# EasyEDA Pro project TC358870 HDMI2MIPI.epro, board driver
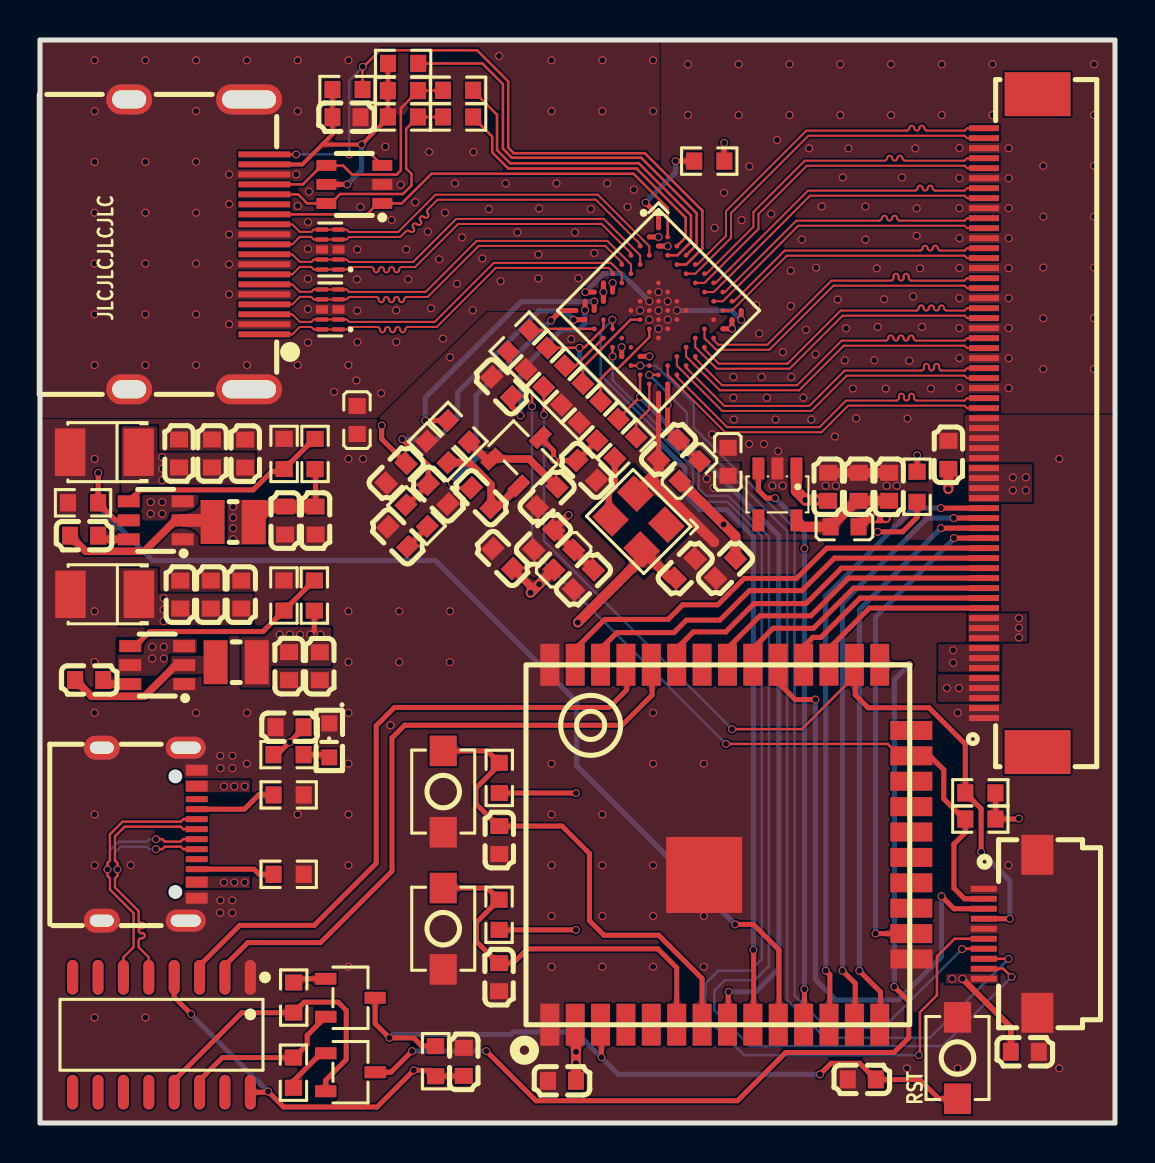
[diagram p8: board, top side]
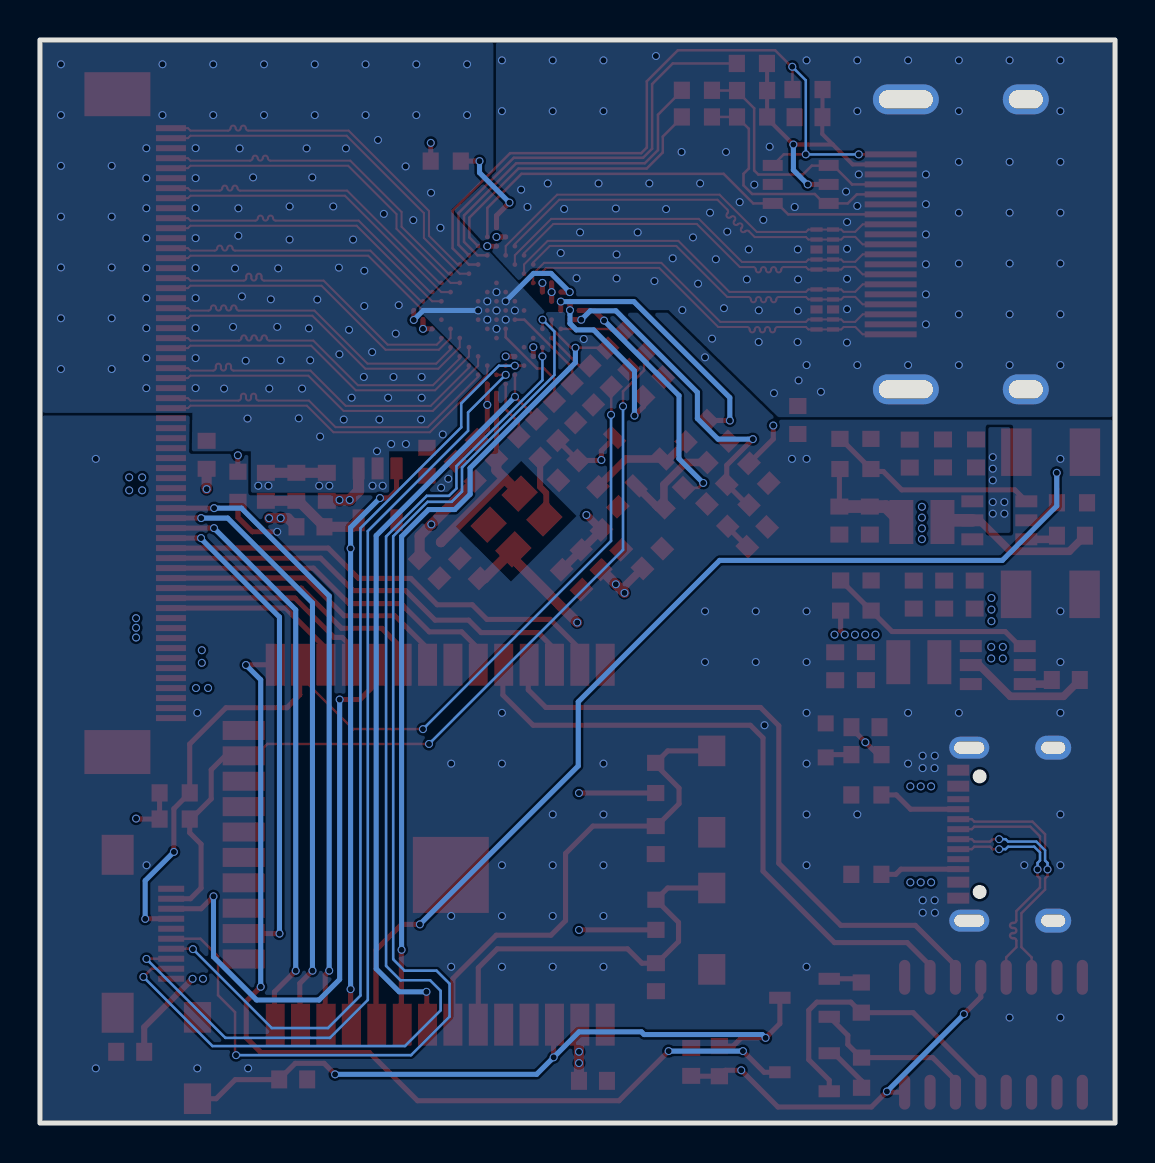
[diagram p9: board, bottom side, seen from below]

Outline 53.79 x 54.16 mm; copper layers: Top Layer, Inner1, Inner2, Bottom Layer. Coordinates in mm from the lower left corner of the outline.
Outline path: rectangle 0,54.16 53.79,0
Stack: Top Layer 0.035mm 外层铜厚1oz / Dielectric1 0.2104mm 7628 RC49% 8.6mil / Inner1 0.0152mm 内层铜厚 / Dielectric2 1.065mm 1.1mm H/HOZ Copper / Inner2 0.0152mm 内层铜厚 / Dielectric3 0.2104mm 7628 RC49% 8.6mil / Bottom Layer 0.035mm 外层铜厚1oz

## Design rules (mm)
net HDMI_CP: HDMI_C
net HDMI_D0P: HDMI_D0
net HDMI_D1P: HDMI_D1
net HDMI_D2P: HDMI_D2
net HDMI_CN: HDMI_C
net HDMI_D0N: HDMI_D0
net HDMI_D1N: HDMI_D1
net HDMI_D2N: HDMI_D2
net MIPI1_D3P: MIPI1_D3
net MIPI1_D3N: MIPI1_D3
net MIPI1_D2P: MIPI1_D2
net MIPI1_D2N: MIPI1_D2
net MIPI1_CP: MIPI1_C
net MIPI1_CN: MIPI1_C
net MIPI1_D1P: MIPI1_D1
net MIPI1_D1N: MIPI1_D1
net MIPI1_D0P: MIPI1_D0
net MIPI1_D0N: MIPI1_D0
net MIPI0_D3N: MIPI0_D3
net MIPI0_D2N: MIPI0_D2
net MIPI0_CN: MIPI0_C
net MIPI0_D1N: MIPI0_D1
net MIPI0_D0N: MIPI0_D0
net MIPI0_D3P: MIPI0_D3
net MIPI0_D2P: MIPI0_D2
net MIPI0_CP: MIPI0_C
net MIPI0_D1P: MIPI0_D1
net MIPI0_D0P: MIPI0_D0
net USB_N: USB
net USB_P: USB
template: 用户自定义配置
spacing copperThickness1oz (default): track to track 0.102, other pairs 0.102 to 0.3
spacing copperThickness2oz: track to track 0.203, other pairs 0.152 to 0.3
spacing copperThicknessInner0.5oz: track to track 0.089, other pairs 0.152 to 0.3
track width copperThickness1oz (default): min 0.102, default 0.254, max 2.54
track width copperThickness0.5oz: min 0.089, default 0.254, max 2.54
track width copperThickness2oz: min 0.203, default 0.254, max 2.54
differential pair differentialPair (default): width min 0.127, default 0.127, max 2.54; gap min 0.127, default 0.127
differential pair 5mil: width min 0.102, default 0.102, max 2.54; gap min 0.152, default 0.152
differential pair usb: width min 0.122, default 0.122, max 0.122; gap min 0.127, default 0.127
via viaSize (default): diameter min 0.399, default 0.399, max 10; hole min 0.3, default 0.3, max 6.299
net HDMI_CP uses 5mil
net HDMI_D0P uses 5mil
net HDMI_D1P uses 5mil
net HDMI_D2P uses 5mil
net HDMI_CN uses 5mil
net HDMI_D0N uses 5mil
net HDMI_D1N uses 5mil
net HDMI_D2N uses 5mil
net MIPI1_D3P uses 5mil
net MIPI1_D3N uses 5mil
net MIPI1_D2P uses 5mil
net MIPI1_D2N uses 5mil
net MIPI1_CP uses 5mil
net MIPI1_CN uses 5mil
net MIPI1_D1P uses 5mil
net MIPI1_D1N uses 5mil
net MIPI1_D0P uses 5mil
net MIPI1_D0N uses 5mil
net MIPI0_D3N uses 5mil
net MIPI0_D2N uses 5mil
net MIPI0_CN uses 5mil
net MIPI0_D1N uses 5mil
net MIPI0_D0N uses 5mil
net MIPI0_D3P uses 5mil
net MIPI0_D2P uses 5mil
net MIPI0_CP uses 5mil
net MIPI0_D1P uses 5mil
net MIPI0_D0P uses 5mil
net USB_N uses usb
net USB_P uses usb
diff pair HDMI_C uses 5mil
diff pair HDMI_D0 uses 5mil
diff pair HDMI_D1 uses 5mil
diff pair HDMI_D2 uses 5mil
diff pair MIPI1_D3 uses 5mil
diff pair MIPI1_D2 uses 5mil
diff pair MIPI1_C uses 5mil
diff pair MIPI1_D1 uses 5mil
diff pair MIPI1_D0 uses 5mil
diff pair MIPI0_D3 uses 5mil
diff pair MIPI0_D2 uses 5mil
diff pair MIPI0_C uses 5mil
diff pair MIPI0_D1 uses 5mil
diff pair MIPI0_D0 uses 5mil
diff pair USB uses usb

## Placement (name value [footprint] x y rotation side)
C1  10uF  [C0603]  15.34 50.3 180 top
C2  10uF  [C0603]  23.15 28.23 315 top
C3  10uF  [C0603]  34.3 27.74 45 top
C4  100nF  [C0603]  25.2 29.17 45 top
C5  100nF  [C0603]  27.35 32.64 135 top
C6  100nF  [C0603]  27.19 27.17 45 top
C7  100nF  [C0603]  31.45 33.68 45 top
C8  1nF  [C0603]  19.92 31.45 135 top
C9  1nF  [C0603]  22.07 31.27 315 top
C10  100nF  [C0603]  23.09 36.82 315 top
C11  100nF  [C0603]  17.9 29.31 315 top
C12  5pF  [C0603]  25.37 31.31 45 top
C15  10uF  [C0603]  17.82 32.49 45 top
C16  10uF  [C0603]  26.12 2.11 0 top
C17  10uF  [C0603]  12.49 19.79 0 top
C18  10uF  [C0603]  49.27 3.56 180 top
C41  100nF  [C0603]  32.28 27.73 225 top
C54  1uF  [C0603]  39.44 31.82 270 top
C55  1uF  [C0603]  40.96 31.82 270 top
C60  10uF  [C0603]  42.48 31.82 270 top
C61  100nF  [C0603]  45.45 33.42 270 top
C71  100nF  [C0603]  2.46 22.16 180 top
C72  10uF  [C0603]  7.02 26.43 270 top
C73  10uF  [C0603]  10.07 26.43 270 top
C74  100nF  [C0603]  8.55 26.43 270 top
C75  22uF  [C0603]  14 22.84 90 top
C76  22uF  [C0603]  12.46 22.85 90 top
C77  100nF  [C0603]  2.21 29.37 180 top
C78  10uF  [C0603]  6.96 33.48 270 top
C79  10uF  [C0603]  10.27 33.48 270 top
C80  100nF  [C0603]  8.61 33.48 270 top
C81  22uF  [C0603]  12.27 30.13 90 top
C82  22uF  [C0603]  13.79 30.13 90 top
C84  100uF  [CAP-SMD_L3.5-W2.8-R-RD]  3.22 33.55 0 top
C86  100uF  [CAP-SMD_L3.5-W2.8-R-RD]  3.24 26.44 0 top
C87  1uF  [C0603]  41.12 2.18 180 top
C88  100nF  [C0603]  21.2 3.06 270 top
C89  100nF  [C0603]  22.97 7.29 90 top
C90  100nF  [C0603]  22.98 14.15 270 top
ESD1  ESD7004MUTAG  [UDFN-10_L2.5-W1.0-P0.50-BL]  14.52 40.69 90 top
ESD2  ESD7004MUTAG  [UDFN-10_L2.5-W1.0-P0.50-BL]  14.52 43.68 90 top
ESD3  NUP4114HMR6T1G  [SOT-23-6_L2.9-W1.6-P0.95-LS2.8-BR]  15.73 46.94 0 top
FB1  BLM18PG121SN1D  [L0603]  26.21 28.17 45 top
FB2  BLM18PG121SN1D  [L0603]  32.51 32.6 45 top
FB3  BLM18PG121SN1D  [L0603]  40.25 29.82 0 top
FB6  BLM18PG121SN1D  [L0603]  15.87 35.16 90 top
FB7  BLM18PG121SN1D  [L0603]  34.42 33.07 90 top
FPC1  AFC01-S60FCA-00  [FPC-SMD_AFC01-S60FCC-00]  48.57 35 90 top
FPC2  AFC01-S10FCA-00  [FPC-SMD_P0.5-10P_FGS-XJ-H2.0]  48.56 9.47 270 top
HDMI1  HDMI 19PIN 043  [HDMI-SMD_HDMI-19PIN-043]  7.84 43.94 270 top
L6  2.2uH  [IND-SMD_L2.5-W2.0]  9.82 23.04 0 top
L7  2.2uH  [IND-SMD_L2.5-W2.0]  9.66 30.06 180 top
LED2  -  [LED0603-R-RD_WHITE]  14.48 19.13 270 top
Q1  S8050  [SOT-23-3_L2.9-W1.6-P1.90-LS2.8-BR]  24.16 33.41 225 top
Q2  S8050  [SOT-23-3_L2.9-W1.6-P1.90-LS2.8-BR]  15.53 2.54 180 top
Q3  S8050  [SOT-23-3_L2.9-W1.6-P1.90-LS2.8-BR]  15.53 6.26 180 top
R3  47kΩ  [R0603]  18.16 50.31 180 top
R4  47kΩ  [R0603]  18.16 51.63 180 top
R5  1kΩ  [R0603]  18.17 52.99 0 top
R6  2.2kΩ  [R0603]  15.39 51.68 0 top
R7  33Ω  [R0603]  20.92 50.31 0 top
R8  33Ω  [R0603]  20.92 51.65 0 top
R9  10kΩ  [R0603]  28.41 34.67 225 top
R10  2kΩ  [R0603]  33.48 48.11 0 top
R11  47kΩ  [R0603]  24.85 38.22 225 top
R12  10kΩ  [R0603]  27.52 35.56 225 top
R13  10kΩ  [R0603]  26.63 36.44 225 top
R14  33Ω  [R0603]  29.29 33.78 225 top
R15  33Ω  [R0603]  25.74 37.33 225 top
R16  33Ω  [R0603]  23.96 39.11 225 top
R17  1.5kΩ  [R0603]  20.93 34.6 315 top
R18  1kΩ  [R0603]  18.84 30.38 135 top
R19  1kΩ  [R0603]  19.88 33.56 315 top
R24  10kΩ  [R0603]  19.79 3.09 270 top
R29  10kΩ  [R0603]  47.05 16.51 0 top
R30  10kΩ  [R0603]  47.05 15.2 0 top
R32  100kΩ  [R0603]  2.15 31.02 180 top
R33  100kΩ  [R0603]  43.88 31.82 270 top
R34  1kΩ  [R0603]  12.43 18.42 0 top
R63  10kΩ  [R0603]  12.2 26.38 270 top
R64  33.2kΩ  [R0603]  13.73 26.38 270 top
R65  10kΩ  [R0603]  12.21 33.46 270 top
R67  4.32kΩ  [R0603]  13.76 33.46 270 top
R74  5.1kΩ  [R0603]  12.44 12.44 180 top
R75  5.1kΩ  [R0603]  12.44 16.41 180 top
R76  10kΩ  [R0603]  12.68 2.52 270 top
R77  10kΩ  [R0603]  12.69 6.27 90 top
R78  10kΩ  [R0603]  22.98 17.26 270 top
R79  10kΩ  [R0603]  22.97 10.41 270 top
SW4  -  [SW-SMD_L4.0-W2.9-LS5.0]  45.9 3.25 90 top
SW5  -  [SW-SMD_L4.0-W2.9-LS5.0]  20.17 9.72 270 top
SW6  -  [SW-SMD_L4.0-W2.9-LS5.0]  20.17 16.57 270 top
U1  TC358870XBG(NOK)  [P-VFBGA-80_L7.0-W7.0-R10-C10-P0.65-TL]  30.95 40.64 315 top
U12  LP5907MFX-1.8/NOPB  [SOT-23-5_L3.0-W1.7-P0.95-LS2.8-BR]  36.9 31.44 90 top
U15  TPS562208DDCR  [SOT-23-6_L2.9-W1.6-P0.95-LS2.8-BR#2]  5.87 22.9 0 top
U16  TPS562208DDCR  [SOT-23-6_L2.9-W1.6-P0.95-LS2.8-BR#2]  5.79 30.14 0 top
U18  ESP32-WROOM-32U-N4  [WIFIM-SMD_38P-L19.2-W18.0-P1.27]  34.55 13.92 180 top
U19  CH340C  [SOP-16_L10.0-W3.9-P1.27-LS6.0-BL]  6.08 4.41 180 top
USB1  TYPE-C 16PIN 2MD(073)  [USB-C-SMD_TYPE-C-6PIN-2MD-073]  5.47 14.45 270 top
X1  48MHz  [OSC-SMD_4P-L3.2-W2.5-BL]  29.94 30.08 135 top

## Footprints (pads in the part's own frame, mm; a bottom-side part is the same pattern mirrored in y, then rotated)
C0603
  rect 0.8x0.9 smd: 1(-0.7,0) 2(0.7,0)
CAP-SMD_L3.5-W2.8-R-RD
  rect 1.524x2.376 smd: 1(1.714,0) 2(-1.714,0)
FPC-SMD_AFC01-S60FCC-00
  rect 0.3x1.5 smd: 1(-14.75,1.34) 2(-14.251,1.34) 3(-13.751,1.34) 4(-13.25,1.34) 5(-12.75,1.34) 6(-12.249,1.34) 7(-11.749,1.34) 8(-11.25,1.34) 9(-10.751,1.34) 10(-10.251,1.34) 11(-9.75,1.34) 12(-9.249,1.34) 13(-8.749,1.34) 14(-8.25,1.34) 15(-7.75,1.34) 16(-7.25,1.34) 17(-6.75,1.34) 18(-6.25,1.34) 19(-5.75,1.34) 20(-5.249,1.34) 21(-4.749,1.34) 22(-4.251,1.34) 23(-3.751,1.34) 24(-3.25,1.34) 25(-2.75,1.34) 26(-2.249,1.34) 27(-1.749,1.34) 28(-1.25,1.34) 29(-0.751,1.34) 30(-0.251,1.34) 31(0.25,1.34) 32(0.75,1.34) 33(1.25,1.337) 34(1.751,1.337) 35(2.252,1.337) 36(2.749,1.34) 37(3.249,1.34) 38(3.75,1.34) 39(4.25,1.34) 40(4.751,1.34) 41(5.251,1.34) 42(5.749,1.34) 43(6.25,1.34) 44(6.75,1.34) 45(7.25,1.34) 46(7.75,1.34) 47(8.251,1.34) 48(8.75,1.34) 49(9.249,1.34) 50(9.749,1.34) 51(10.25,1.34) 52(10.751,1.34) 53(11.251,1.34) 54(11.751,1.34) 55(12.25,1.34) 56(12.749,1.34) 57(13.249,1.34) 58(13.75,1.34) 59(14.251,1.34) 60(14.751,1.34)
  rect 2.2x3.3 smd: 61(-16.45,-1.34) 62(16.45,-1.34)
FPC-SMD_P0.5-10P_FGS-XJ-H2.0
  rect 0.3x1.3 smd: 1(-2.25,-1.339) 2(-1.75,-1.339) 3(-1.25,-1.34) 4(-0.75,-1.339) 5(-0.25,-1.34) 6(0.25,-1.339) 7(0.75,-1.339) 8(1.25,-1.339) 9(1.75,-1.339) 10(2.25,-1.34)
  rect 2x1.6 smd: 11(3.95,1.34) 12(-3.95,1.34)
HDMI-SMD_HDMI-19PIN-043
  rect 0.3x2.6 smd: 1(4.5,3.38) 2(4,3.38) 3(3.5,3.38) 4(3,3.38) 5(2.5,3.38) 6(2,3.38) 7(1.5,3.38) 8(1,3.38) 9(0.5,3.38) 10(0,3.38) 11(-0.5,3.38) 12(-1,3.38) 13(-1.5,3.38) 14(-2,3.38) 15(-2.5,3.38) 16(-3,3.38) 17(-3.5,3.38) 18(-4,3.38) 19(-4.5,3.38)
  oval 1.5x3.3 hole 0.9x2.7: 20(-7.25,2.62) 20(7.25,2.62)
  oval 1.5x2.3 hole 0.9x1.7: 20(-7.25,-3.38) 20(7.25,-3.38)
IND-SMD_L2.5-W2.0
  rect 1.2x2.2 smd: 1(1.028,0) 2(-1.028,0)
L0603
  rect 0.8x0.864 smd: 1(-0.7,0) 2(0.7,0)
LED0603-R-RD_WHITE
  rect 0.8x0.8 smd: 1(0.851,0) 2(-0.851,0)
OSC-SMD_4P-L3.2-W2.5-BL
  rect 1.4x1.2 smd: 1(-1.1,-0.875) 2(1.1,-0.875) 3(1.1,0.875) 4(-1.1,0.875)
P-VFBGA-80_L7.0-W7.0-R10-C10-P0.65-TL
  round 0.24 smd: A1(-2.925,2.925) A2(-2.275,2.925) A3(-1.625,2.925) A4(-0.975,2.925) A5(-0.325,2.925) A6(0.325,2.925) A7(0.975,2.925) A8(1.625,2.925) A9(2.275,2.925) A10(2.925,2.925) B1(-2.925,2.275) B2(-2.275,2.275) B3(-1.625,2.275) B4(-0.975,2.275) B5(-0.325,2.275) B6(0.325,2.275) B7(0.975,2.275) B8(1.625,2.275) B9(2.275,2.275) B10(2.925,2.275) C1(-2.925,1.625) C2(-2.275,1.625) C9(2.275,1.625) C10(2.925,1.625) D1(-2.925,0.975) D2(-2.275,0.975) D4(-0.975,0.975) D5(-0.325,0.975) D6(0.325,0.975) D7(0.975,0.975) D9(2.275,0.975) D10(2.925,0.975) E1(-2.925,0.325) E2(-2.275,0.325) E4(-0.975,0.325) E5(-0.325,0.325) E6(0.325,0.325) E7(0.975,0.325) E9(2.275,0.325) E10(2.925,0.325) F1(-2.925,-0.325) F2(-2.275,-0.325) F4(-0.975,-0.325) F5(-0.325,-0.325) F6(0.325,-0.325) F7(0.975,-0.325) F9(2.275,-0.325) F10(2.925,-0.325) G1(-2.925,-0.975) G2(-2.275,-0.975) G4(-0.975,-0.975) G5(-0.325,-0.975) G6(0.325,-0.975) G7(0.975,-0.975) G9(2.275,-0.975) G10(2.925,-0.975) H1(-2.925,-1.625) H2(-2.275,-1.625) H9(2.275,-1.625) H10(2.925,-1.625) J1(-2.925,-2.275) J2(-2.275,-2.275) J3(-1.625,-2.275) J4(-0.975,-2.275) J5(-0.325,-2.275) J6(0.325,-2.275) J7(0.975,-2.275) J8(1.625,-2.275) J9(2.275,-2.275) J10(2.925,-2.275) K1(-2.925,-2.925) K2(-2.275,-2.925) K3(-1.625,-2.925) K4(-0.975,-2.925) K5(-0.325,-2.925) K6(0.325,-2.925) K7(0.975,-2.925) K8(1.625,-2.925) K9(2.275,-2.925) K10(2.925,-2.925)
R0603
  rect 0.806x0.864 smd: 1(-0.753,0) 2(0.753,0)
SOP-16_L10.0-W3.9-P1.27-LS6.0-BL
  oval 0.56x1.745 smd: 1(-4.445,-2.873) 2(-3.175,-2.873) 3(-1.905,-2.873) 4(-0.635,-2.873) 5(0.635,-2.873) 6(1.905,-2.873) 7(3.175,-2.873) 8(4.445,-2.873) 9(4.445,2.873) 10(3.175,2.873) 11(1.905,2.873) 12(0.635,2.873) 13(-0.635,2.873) 14(-1.905,2.873) 15(-3.175,2.873) 16(-4.445,2.873)
SOT-23-3_L2.9-W1.6-P1.90-LS2.8-BR
  rect 1.07x0.6 smd: 1(1.235,-0.95) 2(1.235,0.95) 3(-1.235,0)
SOT-23-5_L3.0-W1.7-P0.95-LS2.8-BR
  rect 1.1x0.6 smd: 1(1.3,-0.95) 2(1.3,0) 3(1.3,0.95) 4(-1.3,0.95) 5(-1.3,-0.95)
SOT-23-6_L2.9-W1.6-P0.95-LS2.8-BR
  rect 1x0.55 smd: 1(1.4,-0.95) 2(1.4,0) 3(1.4,0.95) 4(-1.4,0.95) 5(-1.4,0) 6(-1.4,-0.95)
SOT-23-6_L2.9-W1.6-P0.95-LS2.8-BR#2
  rect 1.1x0.6 smd: 1(1.35,-0.95) 2(1.35,0) 3(1.35,0.95) 4(-1.35,0.95) 5(-1.35,0) 6(-1.35,-0.95)
SW-SMD_L4.0-W2.9-LS5.0
  rect 1.53x1.36 smd: 1(-2.035,0) 2(2.035,0)
UDFN-10_L2.5-W1.0-P0.50-BL
  rect 0.22x0.609 smd: 1(-1,-0.414) 2(-0.5,-0.414) 4(0.5,-0.414) 5(1,-0.414) 6(1,0.414) 7(0.5,0.414) 9(-0.5,0.414) 10(-1,0.414)
  rect 0.41x0.609 smd: 3(0,-0.414) 8(0,0.414)
USB-C-SMD_TYPE-C-6PIN-2MD-073
  rect 0.55x1.1 smd: 1(-3.2,2.375) 2(-2.4,2.375) 11(2.4,2.375) 12(3.2,2.375)
  rect 0.3x1.1 smd: 3(-1.75,2.375) 4(-1.25,2.375) 5(-0.75,2.375) 6(-0.25,2.375) 7(0.25,2.375) 8(0.75,2.375) 9(1.25,2.375) 10(1.75,2.375)
  oval 1.1x2 hole 0.6x1.5: 13(-4.325,1.825) 14(4.325,1.825)
  oval 1.2x1.8 hole 0.6x1.2: 13(-4.325,-2.375) 14(4.325,-2.375)
WIFIM-SMD_38P-L19.2-W18.0-P1.27
  rect 0.95x2.1 smd: 1(9.045,9) 2(7.775,9) 3(6.505,9) 4(5.235,9) 5(3.965,9) 6(2.695,9) 7(1.425,9) 8(0.155,9) 9(-1.115,9) 10(-2.385,9) 11(-3.655,9) 12(-4.925,9) 13(-6.195,9) 14(-7.465,9) 25(-7.465,-9) 26(-6.195,-9) 27(-4.925,-9) 28(-3.655,-9) 29(-2.385,-9) 30(-1.115,-9) 31(0.155,-9) 32(1.425,-9) 33(2.695,-9) 34(3.965,-9) 35(5.235,-9) 36(6.505,-9) 37(7.775,-9) 38(9.045,-9)
  rect 2.1x0.95 smd: 15(-9.045,5.715) 16(-9.045,4.445) 17(-9.045,3.175) 18(-9.045,1.905) 19(-9.045,0.635) 20(-9.045,-0.635) 21(-9.045,-1.905) 22(-9.045,-3.175) 23(-9.045,-4.445) 24(-9.045,-5.715)
  rect 3.8x3.8 smd: 39(1.321,1.51)

## Nets
As in the schematic, except:
V3.3: C2.2 C15.2 C16.2 C17.2 C18.2 C41.2 C54.2 C75.2 C76.2 C88.2 FB1.1 FPC1.9 FPC1.10 FPC1.11 FPC2.10 L6.1 R24.2 R29.2 R30.2 R34.1 R64.2 R78.2 R79.2 U12.1 U18.2 U19.4 U19.16 X1.4
LX_3.3: C71.2 L6.2 U15.2

Pads without a net: FPC1 61 62; HDMI1 14; U1 J5 J6 J8; U12 4; U18 4 5 17 18 19 20 21 22 24 32; U19 7 8 9 10 11 12 15; USB1 3 9; X1 1

## Via types
v1: diameter 0.399, hole 0.299, Top Layer to Bottom Layer, 330 vias
v2: diameter 0.4, hole 0.3, Top Layer to Bottom Layer, 72 vias

## Routing (per net, layer and track width the routed paths; a pad name or vN(x,y) marks a point on that pad's centre or on a via; arc(x,y) is an arc through that point)
GND: length 21.6
  Top Layer w0.254: v1(35.08,40.16) 35.08,40.16 U1.A10 ; v1(41.92,29.57) 43.16,29.57 43.88,30.29 R33.2 ; U1.K10 30.95,34.04 30.95,34.04 C7.1 ; U1.H1 v2(27.28,41.55)
  Top Layer w0.508: C7.1 30.95,32.64 30.54,32.23 ; 30.54,32.23 29.78,31.48 ; 30.54,32.23 33.72,29.05 33.72,29.05
  Bottom Layer w0.254: v1(35.08,40.16) 34.61,40.64 v2(31.87,40.64) ; v2(27.28,41.55) 28.22,42.49 29.09,42.49 30.48,41.09
  vias: v1(2.73,33.21) v1(2.73,25.59) v1(2.73,23.05) v1(2.73,20.51) v1(2.73,15.43) v1(2.73,12.89) v1(2.73,5.27) v1(4.54,12.9) v1(5.27,5.27) v1(7.81,20.51) v1(10.35,20.51) v1(10.35,17.97) v1(12.89,15.43) v1(15.43,33.21) v1(15.43,25.59) v1(15.43,23.05) v1(15.43,20.51) v1(15.43,17.97) v1(15.43,15.43) v1(15.43,12.89) v1(15.43,7.81) v1(16.16,33.21) v1(17.54,19.89) v1(17.97,25.59) v1(17.97,23.05) v1(20.51,38.29) v1(20.51,25.59) v1(20.51,23.05) v1(25.59,17.97) v1(25.59,15.43) v1(25.59,12.89) v1(25.59,10.35) v1(25.59,7.81) v1(28.13,15.43) v1(28.13,12.89) v1(28.13,10.35) v1(28.13,7.81) v1(30.67,20.51) v1(30.67,17.97) v1(30.67,12.89) v1(30.67,10.35) v1(30.67,7.81) v1(33.21,17.97) v1(33.21,10.35) v1(33.21,7.81) v1(33.36,32.22) v1(33.72,31.77) v1(43.37,2.73) v1(45.91,20.51) v1(45.91,2.73) v1(48.45,12.89) v1(50.99,33.21) v1(50.99,2.73) v2(9.02,18.37) v2(9.03,17.75) v2(9.02,11.14) v2(9.01,10.52) v2(9.63,18.37) v2(9.63,17.75) v2(9.62,11.14) v2(9.62,10.52) v2(26.58,39.21) v2(30.03,40.64) v2(30.49,41.09) v2(30.49,40.18) v2(30.95,41.55) v2(30.94,40.64) v2(30.94,39.72) v2(31.41,41.09) v2(31.41,40.18)
GND_P: length 3
  Top Layer w0.508: C54.1 C55.1 C60.1
  vias: v1(32.42,52.95) v1(32.42,50.41) v1(33.63,34.44) v1(33.75,44.77) v1(34.22,46.52) v1(34.69,37.31) v1(34.69,36.27) v1(34.72,35.18) v1(34.96,52.95) v1(34.96,50.41) v1(35.11,45.15) v1(35.49,47.84) v1(35.48,33.96) v1(35.84,40.9) v1(35.99,39.48) v1(36.1,37.31) v1(36.22,33.96) v1(36.37,36.27) v1(36.58,45.47) v1(36.8,35.18) v1(36.88,49.16) v1(36.93,33.6) v1(37.17,38.55) v1(37.5,52.95) v1(37.5,50.41) v1(37.56,42.62) v1(37.56,40.86) v1(37.58,37.31) v1(38.12,44.18) v1(38.2,36.27) v1(38.32,39.67) v1(38.48,48.74) v1(38.59,35.18) v1(38.81,38.45) v1(38.83,42.78) v1(39.11,45.84) v1(39.77,34.33) v1(39.91,41.18) v1(40.04,52.95) v1(40.04,50.41) v1(40.16,47.29) v1(40.27,38.14) v1(40.33,39.74) v1(40.45,48.74) v1(40.67,36.73) v1(40.84,35.24) v1(41.29,45.84) v1(41.3,44.18) v1(41.74,38.14) v1(41.87,42.74) v1(41.91,39.81) v1(42.23,41.19) v1(42.31,36.73) v1(42.58,52.95) v1(42.58,50.41) v1(43.12,47.29) v1(43.4,35.23) v1(43.49,38.12) v1(43.68,41.34) v1(43.8,48.74) v1(43.86,45.74) v1(43.86,44.37) v1(44.03,42.74) v1(44.13,39.81) v1(44.57,36.73) v1(45.12,52.95) v1(45.12,50.41) v1(46,48.75) v1(46,47.25) v1(46,45.75) v1(46,44.25) v1(46,42.75) v1(46,41.25) v1(46,39.75) v1(46,38.25) v1(46,36.75) v1(47.66,52.95) v1(47.66,50.41) v1(48.46,48.75) v1(48.46,47.25) v1(48.46,45.75) v1(48.46,44.25) v1(48.46,42.75) v1(48.46,41.25) v1(48.46,39.75) v1(48.46,38.25) v1(48.47,36.75) v1(50.2,47.87) v1(50.2,45.33) v1(50.2,42.79) v1(50.2,40.25) v1(50.2,37.71) v1(52.74,52.95) v1(52.74,50.41) v1(52.74,47.87) v1(52.74,45.33) v1(52.74,42.79) v1(52.74,40.25) v1(52.74,37.71) v2(36.64,31.87) v2(37.15,31.87) v2(39.31,31.87) v2(39.82,31.87) v2(42.36,31.87) v2(42.86,31.87)
GND_TMDS:
  vias: v1(2.73,53.14) v1(2.73,50.6) v1(2.73,48.06) v1(2.73,45.52) v1(2.73,42.98) v1(2.73,40.44) v1(2.73,37.9) v1(5.27,53.14) v1(5.27,48.06) v1(5.27,45.52) v1(5.27,42.98) v1(5.27,40.44) v1(5.27,37.9) v1(7.81,53.14) v1(7.81,50.6) v1(7.81,48.06) v1(7.81,45.52) v1(7.81,42.98) v1(7.81,40.44) v1(7.81,37.9) v1(10.35,53.14) v1(10.35,37.9) v1(12.89,53.14) v1(12.89,50.6) v1(12.9,45.86) v1(12.89,37.9) v1(13.46,46.58) v1(14.71,36.57) v1(15.43,53.14) v1(15.43,37.9) v1(15.87,43.69) v1(15.86,42.19) v1(15.87,40.62) v1(15.88,39.06) v1(15.83,37.14) v1(17.06,36.5) v1(17.28,48.83) v1(17.6,45.17) v1(17.82,40.64) v1(17.83,39.06) v1(18.32,43.69) v1(18.42,42.19) v1(18.78,46.05) v1(19.4,44.58) v1(19.46,48.56) v1(19.56,40.75) v1(19.97,43.2) v1(20.16,39.23) v1(20.26,45.53) v1(20.76,46.99) v1(20.86,41.97) v1(21.11,44.29) v1(21.69,48.56) v1(21.65,40.65) v1(22.13,43.25) v1(22.46,45.7) v1(22.97,53.36) v1(23.04,42.11) v1(23.3,46.99) v1(23.88,44.54) v1(24.97,45.73) v1(24.94,43.44) v1(24.94,42.24) v1(25.59,53.14) v1(25.59,50.6) v1(25.84,46.99) v1(26.77,44.54) v1(26.94,42.25) v1(27.56,45.71) v1(27.73,43.51) v1(28.13,53.14) v1(28.13,50.6) v1(28.38,46.99) v1(29.39,45.81) v1(29.71,46.68) v1(30.67,53.14) v1(30.67,50.6) v2(9.46,47.44) v2(9.46,45.95) v2(9.46,44.44) v2(9.46,42.95) v2(9.46,41.44) v2(9.46,39.94) v2(12.82,47.44) v2(13.41,45.06) v2(13.41,43.72) v2(13.41,42.22) v2(13.41,40.7) v2(13.41,39.03) v2(16.03,45.81) v2(18.05,46.93)
V1.1: length 55
  Top Layer w0.254: R67.2 13.79,32.68 C82.2
  Top Layer w0.508: FB2.1 33.07,31.05 33.09,31.05 v2(34.21,29.94) 34.79,29.35 C3.2
  Top Layer w0.635: C82.2 C81.2 11.46,30.83 L7.2
  Inner2 w0.762: v1(9.66,29.2) v1(9.66,29.74) v1(9.66,30.28) v1(9.66,30.82) 9.67,30.83 19.75,30.83 22.03,28.55 26.18,28.55 28.4,26.33 30.6,26.33 v2(34.21,29.94) 42.39,21.75 v1(45.38,21.75) v1(45.98,21.75)
V1.1_TC: length 24.3
  Top Layer w0.254: U1.K6 29.1,38.34 v2(29.1,38.8) ; 28.65,41.56 v2(28.65,42.01) ; 34.16,39.72 v2(34.62,39.72) U1.B10 ; v2(31.41,43.85) U1.B2 ; U1.J10 v2(31.41,35.91) 31.41,34.71 C7.2 31.94,34.16 FB2.2
  Inner2 w0.254: 29.32,39.02 29.32,41.34 v2(28.65,42.01) 29.57,42.01 30.17,42.61 ; 29.32,39.02 v2(29.1,38.8) ; 29.32,39.02 30.62,39.02 31.41,38.23 v2(31.41,35.91) ; v2(34.62,39.72) 31.72,42.61 30.17,42.61 ; 30.17,42.61 v2(31.41,43.85)
V1.8: length 5.3
  Top Layer w0.508: C55.2 40.98,31.1 ; C55.2 40.85,31.12 FB3.1 38.16,29.82 U12.5 ; C55.2 C60.2
V1.8_P: length 15.5
  Top Layer w0.508: FB3.2 41.38,30.25 v1(41.74,30.25) v1(42.32,30.25) ; v1(45.45,31.7) C61.2
  Inner2 w0.762: v1(45.45,31.7) 44.38,31.7 42.93,30.25 v1(42.32,30.25) ; v1(42.32,30.25) 45.69,26.88 v1(45.69,23.65) v1(45.69,23.01) ; v1(42.32,30.25) v1(41.74,30.25)
V3.3: length 196.4
  Top Layer w0.254: R79.2 26.81,9.66 v1(26.82,9.66) ; C17.2 13.19,19.74 11.86,18.42 R34.1 ; v1(26.82,16.5) 26.81,16.5 R78.2 ; R29.2 R30.2 48.95,15.2 v1(48.98,15.22) ; U19.4 6.71,6.29 v1(7.56,5.45) ; R64.2 13.73,24.63 v1(13.52,24.42) ; C15.2 17.1,34.21 v1(17.1,34.88) ; U19.16 11.38,1.54 v1(11.41,1.58) 12.19,0.8 16.87,0.8 v1(18.7,2.64) 19.5,2.64 R24.2 21.19,2.34 C88.2
  Top Layer w0.305: v1(46.15,7.21) 48.57,4.79 C18.2
  Top Layer w0.381: v1(24.54,26.51) 24.54,26.84 C2.2
  Top Layer w0.508: v1(26.91,25.03) 30.1,28.22 X1.4 31.55,27.24 C41.2 ; C16.2 v1(26.82,3) v1(26.82,3.56) 26.82,4.91 26.82,4.92 ; FB1.1 25.7,27.67 v1(24.97,26.94) v1(24.54,26.51)
  Top Layer w0.559: v2(38.8,31.16) v2(38.29,31.16) 37.84,31.6 U12.1 ; 39.39,31.16 38.8,31.16
  Inner2 w0.254: v1(11.99,24.42) 12.49,23.92 v1(12.49,19.04) ; v1(18.7,2.64) 19.06,3 v1(26.82,3)
  Inner2 w0.762: v1(48.98,15.22) v1(48.98,24.28) v1(48.98,24.77) v1(48.98,25.25) 48.98,29.47 47.17,31.27 47.17,32.48 45.41,34.25 42.13,34.25 41.29,33.41 39.31,33.41 38.29,32.38 v2(38.29,31.16) v2(38.8,31.16) ; v1(48.98,15.22) 49.94,14.26 49.94,6.91 49.03,6 47.37,6 v1(46.15,7.21) v1(45.63,7.21) ; v1(48.98,15.22) 31.81,15.22 26.82,20.21 ; 26.82,20.21 v1(26.82,16.5) v1(26.82,9.66) v1(26.82,3.56) v1(26.82,3) ; 26.82,20.21 26.82,25.12 ; v1(17.1,34.88) 16.29,34.08 10.65,34.08 8.22,31.65 8.22,28.19 v1(11.99,24.42) v1(12.5,24.42) v1(13.01,24.42) v1(13.52,24.42) v1(14.03,24.42) 22.45,24.42 v1(24.54,26.51) v1(24.97,26.94) 24.99,26.94 26.82,25.12 ; 26.82,25.12 v1(26.91,25.03)
  Bottom Layer w0.254: v1(7.56,5.45) 7.56,5.42 v1(11.41,1.58)
V3.3_TC: length 36.7
  Top Layer w0.254: v2(30.95,44.31) U1.B1 ; R10.2 34.23,48.11 v1(34.23,49.02) ; R9.2 26.87,33.13 25.72,33.13 v2(25.7,33.16) 25.7,33.62 25.03,34.28 ; U1.J7 v2(30.49,38.34) ; U1.H2 v2(28.19,41.55) U1.G1
  Top Layer w0.381: 27.68,27.67 26.71,28.65 FB1.2 26.69,28.66 C4.2 26.44,30.41 v1(26.45,30.41)
  Inner2 w0.254: v2(30.49,38.34) 29.45,38.34 28.94,37.83 28.31,37.83 27.79,37.31 27.79,40.13 28.19,40.53 v2(28.19,41.55) 28.19,42.3 30.2,44.31 v2(30.95,44.31) 34.23,47.6 v1(34.23,49.02)
  Inner2 w0.508: v1(26.45,30.41) 26.45,32.41 v2(25.7,33.16) 27.79,35.25 27.79,37.31
V5: length 104.9
  Inner2 w1.27: v1(6.12,33.3) v1(6.12,32.72) v1(6.12,32.14) v1(6.12,31.05) v1(5.54,30.47) 5.54,26.9 v1(6.18,26.26) 6.19,26.25 v1(6.19,23.81) v1(5.61,23.23) 5.01,22.63 5.01,16.44 6.96,14.49 11.54,14.49 16.39,9.64 16.39,2.93 18.12,1.2 46.7,1.2 51.72,6.22 51.72,30.93 50.67,31.98 48.88,31.98
  vias: v1(5.54,31.05) v1(5.61,23.81) v1(6.12,30.47) v1(6.18,25.68) v1(6.18,25.1) v1(6.19,23.23) v1(48.67,32.29) v1(48.67,31.64) v1(49.32,32.29) v1(49.32,31.64) v2(9.2,16.84) v2(9.2,12.04) v2(9.72,16.84) v2(9.72,12.04) v2(10.24,16.84) v2(10.24,12.04)
V5_HDMI: length 16.2
  Top Layer w0.203: R5.1 17.41,52.98 17.41,50.25 v1(16.09,48.93) 14.12,48.93 ; 11.23,47.94 13.13,47.94 14.12,48.93 ; 14.12,48.93 14.65,49.46 14.65,50.29 C1.2 14.64,51.68 R6.1
  Top Layer w0.254: ESD3.5 v1(15.37,46.94)
  Bottom Layer w0.254: v1(16.09,48.93) 16.09,47.66 v1(15.37,46.94)
BIASDA: length 8.7
  Top Layer w0.254: v1(24.04,35.38) 23.59,35.83 C10.2 ; U1.J1 v2(27.27,40.65)
  Bottom Layer w0.254: v2(27.27,40.65) 27.27,39.98 26.95,39.66 26.09,39.66 24.04,37.62 v1(24.04,35.38)
BS_1.1: length 1.6
  Top Layer w0.381: U16.6 3.09,29.19 C77.1
BS_3.3: length 1.4
  Top Layer w0.381: C71.1 3.37,21.95 U15.6
BTN1: length 19.6
  Top Layer w0.254: SW5.1 22.38,11.75 R79.1 21.84,10.04 21.84,9.07 22.92,7.99 C89.2 23.67,7.99 24.39,8.71 30.91,8.71 31.86,7.76 U18.6
BTN2: length 24.8
  Top Layer w0.254: SW6.1 22.38,18.61 R78.1 22.98,17.92 21.81,16.75 21.81,15.97 22.93,14.85 C90.1 26.12,14.85 27.49,13.48 27.49,10.12 28.22,9.39 30.96,9.39 33.13,7.22 U18.7
CEC: length 23.2
  Top Layer w0.127: U1.A2 31.41,45.76 29.7,47.47 19.58,47.47 18.1,45.99 ESD3.1 16.9,45.99 16.35,45.44 HDMI1.13
CLK_TC: length 2.9
  Top Layer w0.127: R14.1 29.83,35.03 30.49,35.69 U1.K9
DAOUT: length 13.2
  Top Layer w0.254: R17.1 19.28,35.14 v2(19.27,35.13) ; U1.J2 v2(27.73,41.08)
  Bottom Layer w0.254: v2(27.73,41.08) 24.07,41.08 19.27,36.28 v2(19.27,35.13)
DDC_SCL: length 13
  Top Layer w0.127: HDMI1.15 12.92,46.44 13.37,45.99 ESD3.6 14.55,45.99 15.02,46.46 18.16,46.46 18.59,46.89 18.59,47.47 18.32,47.74 18.32,49.72 R3.1 R7.1
DDC_SDA: length 13.1
  Top Layer w0.127: R8.1 20.15,51.63 R4.1 18.91,51.61 18.05,50.75 18.05,47.64 17.85,47.43 15.61,47.43 15.17,47.88 14.34,47.88 ESD3.4 14.1,47.89 13.16,46.95 13.16,46.94 HDMI1.16
DTR: length 15.5
  Top Layer w0.254: Q2.2 14.3,2.14 15.32,3.17 15.32,5.64 14.92,6.05 13.22,6.05 R77.1 10.1,5.52 6.71,2.13 U19.13
EN_V1.1: length 53.9
  Top Layer w0.254: 36.98,4.92 36.98,8.65 35.69,9.93 v1(34.78,9.93) ; v1(2.91,32.52) 2.91,31.71 2.91,31.7 R32.1 3.78,30.14 U16.5
  Bottom Layer w0.254: v1(34.78,9.93) 26.85,17.86 26.85,21.06 19.78,28.14 5.64,28.14 2.91,30.86 v1(2.91,32.52)
EN_V1.8: length 37.4
  Top Layer w0.254: v1(36.78,31.25) 36.33,31.25 35.94,31.64 U12.3 ; 38.25,4.92 v1(38.25,6.69) ; R33.1 43.88,32.58 v1(43.88,33.39)
  Inner2 w0.254: v1(43.88,33.39) 42.9,33.39 v1(38.25,28.74)
  Bottom Layer w0.254: v1(36.78,31.25) 38.25,29.78 v1(38.25,28.74) v1(38.25,6.69)
FB_1.1: length 10.6
  Top Layer w0.254: U16.4 5.01,31.66 10.67,31.66 11.59,32.58 12.12,32.58 12.21,32.67 R65.2 13.72,34.21 R67.1
FB_3.3: length 10.6
  Top Layer w0.254: U15.4 4.77,23.85 5.5,24.58 11.16,24.58 R63.2 13.71,27.13 R64.1
HDMI_CN: length 21.8
  Top Layer w0.102: HDMI1.12 12.62,44.94 13,44.57 13.58,44.57 13.7,44.68 ESD2.6 ESD2.5 15.34,44.68 15.46,44.56 17.92,44.56 19.79,46.43 27.91,46.43 30.49,43.85 U1.C2
HDMI_CP: length 21.8
  Top Layer w0.102: U1.C1 30.03,43.95 27.81,46.17 19.89,46.17 19.39,45.67 arc(19.36,45.59) 19.39,45.5 19.41,45.48 arc(19.41,45.3) 19.23,45.3 19.21,45.32 arc(19.03,45.32) 19.03,45.14 19.05,45.12 arc(19.05,44.94) 18.87,44.94 18.85,44.96 arc(18.68,44.96) 18.68,44.78 18.69,44.76 arc(18.69,44.58) 18.51,44.58 18.5,44.6 arc(18.41,44.63) 18.32,44.6 18.03,44.31 15.46,44.31 15.34,44.18 ESD2.4 ESD2.7 13.7,44.18 13.57,44.31 13,44.31 12.62,43.94 HDMI1.10
HDMI_D0N: length 21.2
  Top Layer w0.102: HDMI1.9 12.62,43.44 13,43.07 13.58,43.07 13.7,43.18 ESD2.9 ESD2.2 15.34,43.18 15.46,43.06 18.66,43.06 20.82,45.22 28.21,45.22 30.03,43.39 U1.D2
HDMI_D0P: length 21.2
  Top Layer w0.102: 29.57,43.39 29.57,43.5 28.1,44.96 20.92,44.96 18.77,42.81 18.1,42.81 arc(18.01,42.77) 17.97,42.68 17.97,42.66 arc(17.84,42.54) 17.72,42.66 17.72,42.68 arc(17.59,42.81) 17.46,42.68 17.46,42.66 arc(17.34,42.54) 17.21,42.66 17.21,42.68 arc(17.08,42.81) 16.95,42.68 16.95,42.66 arc(16.83,42.54) 16.7,42.66 16.7,42.68 arc(16.66,42.77) 16.57,42.81 15.46,42.81 15.34,42.68 ESD2.1 ESD2.10 13.7,42.68 13.57,42.81 13,42.81 12.62,42.44 HDMI1.7
HDMI_D1N: length 20.6
  Top Layer w0.102: 29.57,42.47 29.57,42.93 28.38,44.12 21.84,44.12 19.29,41.56 15.46,41.56 15.34,41.69 ESD1.5 ESD1.6 13.7,41.69 13.58,41.57 13,41.57 12.62,41.94 HDMI1.6
HDMI_D1P: length 20.6
  Top Layer w0.102: U1.E1 29.11,43.03 28.28,43.86 21.95,43.86 19.4,41.31 18.35,41.31 arc(18.26,41.27) 18.22,41.18 18.22,41.17 arc(18.09,41.04) 17.97,41.17 17.97,41.18 arc(17.84,41.31) 17.71,41.18 17.71,41.17 arc(17.58,41.04) 17.46,41.17 17.46,41.18 arc(17.33,41.31) 17.2,41.18 17.2,41.17 arc(17.08,41.04) 16.95,41.17 16.95,41.18 arc(16.91,41.27) 16.82,41.31 15.46,41.31 15.34,41.19 ESD1.4 ESD1.7 13.7,41.19 13.57,41.31 13,41.31 12.62,40.94 HDMI1.4
HDMI_D2N: length 20.1
  Top Layer w0.102: U1.F2 29.11,42.47 28.56,43.02 22.7,43.02 19.75,40.06 15.46,40.06 15.34,40.19 ESD1.2 ESD1.9 13.7,40.19 13.58,40.06 13,40.06 12.62,40.44 HDMI1.3
HDMI_D2P: length 20.1
  Top Layer w0.102: 28.65,42.47 28.65,42.58 28.46,42.76 22.8,42.76 19.85,39.81 18.4,39.81 arc(18.31,39.77) 18.28,39.68 18.28,39.66 arc(18.15,39.54) 18.02,39.66 18.02,39.68 arc(17.9,39.81) 17.77,39.68 17.77,39.66 arc(17.64,39.54) 17.52,39.66 17.52,39.68 arc(17.39,39.81) 17.26,39.68 17.26,39.66 arc(17.13,39.54) 17.01,39.66 17.01,39.68 arc(16.97,39.77) 16.88,39.81 15.46,39.81 15.34,39.69 ESD1.1 ESD1.10 13.7,39.69 13.58,39.81 12.99,39.81 12.62,39.44 HDMI1.1
HPDI: length 21.3
  Top Layer w0.127: R5.2 22.13,52.99 23.16,51.96 23.16,48.72 23.61,48.27 30.08,48.27 32.85,45.5 32.85,43.92 32.32,43.39
HPDO: length 38
  Top Layer w0.127: ESD3.3 16.57,48.44 v2(15.47,48.44) ; U1.B4 32.33,42.93 33.14,43.74 33.14,45.62 30.26,48.5 23.71,48.5 23.43,48.78 23.43,52.09 21.87,53.65 17.01,53.65 16.18,52.82 v1(16.15,52.82) 16.14,52.82 R6.2 ; HDMI1.19 v2(12.82,48.44)
  Bottom Layer w0.127: v2(12.82,48.44) v2(15.47,48.44) 15.47,52.15 v1(16.15,52.82)
I2S_OSCK: length 61.2
  Top Layer w0.127: FPC2.6 45.75,9.22 44.88,8.34 44.88,6.39 44.03,5.54 44.03,3.44 v1(43.97,3.39) ; v2(28.64,40.18) 28.64,39.72 28.65,39.72
  Bottom Layer w0.127: v2(28.64,40.18) 28.05,39.58 28.05,37.41 32.67,32.78 32.67,31.58 33.19,31.06 34.39,31.06 36.11,29.34 36.11,8.19 35.54,7.62 33.94,7.62 33.29,6.97 33.29,5.32 35.22,3.39 v1(43.97,3.39)
I2S_SCK: length 47.4
  Top Layer w0.127: v2(30.03,37.87) 30.02,37.88 29.57,37.88 ; FPC2.7 46.15,8.72 v1(46.13,8.7)
  Bottom Layer w0.127: v2(30.03,37.87) 30.82,37.87 32.71,35.99 32.71,34.79 37.75,29.75 37.75,6.37 39.38,4.75 42.19,4.75 v1(46.13,8.7)
I2S_SD0: length 49.3
  Top Layer w0.127: U1.J9 30.94,37.42 v2(30.49,37.42) ; v1(48.46,8.2) 48.45,8.22 FPC2.8
  Bottom Layer w0.127: v2(30.49,37.42) 32.37,35.53 32.37,34.62 37.38,29.6 37.38,6.15 39.28,4.26 44.51,4.26 v1(48.46,8.2)
I2S_WFS: length 57.7
  Top Layer w0.127: v1(48.61,7.31) 48.2,7.72 FPC2.9 ; U1.K5 28.65,38.34
  Bottom Layer w0.127: v1(48.61,7.31) 45.15,3.85 35.52,3.85 33.74,5.63 33.74,6.61 34.27,7.14 35.75,7.14 36.47,7.85 36.47,29.33 34.43,31.36 33.32,31.36 32.95,31.73 32.95,32.85 28.65,37.15 v2(28.65,38.34)
IIC_SCL: length 47.3
  Top Layer w0.127: v1(34.62,19.7) 38.12,19.7 40.79,22.37 ; R15.2 25.21,35.43 v2(25.22,35.42)
  Top Layer w0.254: v1(48.52,10.21) 48.51,10.22 FPC2.4 ; 40.79,22.92 40.79,21.41 41.43,20.77 44.48,20.77 46.29,18.95 R29.1 47.09,15.72 v1(47.09,13.56)
  Bottom Layer w0.127: v1(34.62,19.7) 25.22,29.11 v2(25.22,35.42)
  Bottom Layer w0.254: v1(47.09,13.56) 48.52,12.12 v1(48.52,10.21)
IIC_SDA: length 43.9
  Top Layer w0.127: v1(34.32,18.96) 42.41,18.96 43.01,18.36 43.56,18.36 ; v2(24.62,35.84) 24.62,36.59 23.56,37.64 23.56,38.45 R16.2
  Top Layer w0.254: FPC2.2 46.26,11.22 45.73,11.75 45.73,13.95 46.29,14.52 R30.1 46.23,15.2 45.22,16.21 45.22,17.66 44.52,18.36 43.56,18.36
  Bottom Layer w0.127: v1(34.32,18.96) 24.62,28.66 v2(24.62,35.84)
INT_TC: length 41.9
  Top Layer w0.127: U1.J3 28.19,39.74 27.22,38.77 v2(27,38.77) 25.4,38.77 R11.1
  Top Layer w0.254: 35.71,4.92 35.71,8.65 v1(35.69,8.66)
  Bottom Layer w0.254: v2(27,38.77) 27,38.03 32.26,32.76 32.26,31.44 33.03,30.68 34.34,30.68 35.69,29.33 v1(35.69,8.66)
IO0: length 50.1
  Top Layer w0.254: v1(43.48,22.91) 43.47,22.92 42.06,22.92 ; v1(22.33,3.6) 24.82,1.11 34.89,1.11 37.31,3.53 42.73,3.53 43.47,4.26 43.47,6.09 v1(42.74,6.81) ; v1(18.62,3.6) 17.56,2.54 Q2.3
  Bottom Layer w0.254: v1(42.74,6.81) 42.74,22.17 v1(43.48,22.91) ; v1(18.62,3.6) v1(22.33,3.6)
IO1: length 9.4
  Top Layer w0.254: 39.52,22.92 39.52,23.77 41.5,25.75 FPC1.12
IO2: length 11.5
  Top Layer w0.254: 38.21,23.47 38.25,22.92 ; 38.21,23.47 U18.28 ; 38.21,23.47 38.21,23.83 38.67,24.28 39.06,24.28 41.03,26.25 FPC1.13
IO3: length 13.6
  Top Layer w0.254: 35.71,22.92 35.71,23.77 36.68,24.74 38.7,24.74 40.71,26.75 FPC1.14
IO4: length 15.1
  Top Layer w0.254: FPC1.15 40.45,27.25 38.57,25.36 36.02,25.36 34.44,23.78 34.44,22.92
IO5: length 17.8
  Top Layer w0.254: 31.9,22.92 31.9,23.77 32.69,24.56 34.31,24.56 35.72,25.98 38.33,25.98 40.1,27.75 FPC1.16
IO6: length 21.8
  Top Layer w0.254: FPC1.17 39.75,28.25 38.12,26.62 35.49,26.62 34.02,25.15 32.34,25.15 31.72,24.53 28.86,24.53 28.09,23.75 28.09,22.92
IO7: length 23.3
  Top Layer w0.254: 26.82,22.92 26.82,23.74 28.26,25.19 31.42,25.19 32.16,25.92 33.91,25.92 35.23,27.24 37.85,27.24 39.36,28.75 FPC1.18
IO8: length 24.5
  Top Layer w0.254: 43.56,9.47 v1(41.8,9.47) ; FPC1.19 v1(45.73,29.25)
  Bottom Layer w0.254: v1(45.73,29.25) 45.73,29.23 41.8,25.3 41.8,9.6
IO9: length 29.1
  Top Layer w0.254: 47.23,29.75 v1(45.08,29.75) ; v1(40.99,7.62) 42.06,6.55 42.06,4.92
  Bottom Layer w0.254: v1(45.08,29.75) 40.99,25.66 v1(40.99,7.62)
IO10: length 30.2
  Top Layer w0.254: v1(40.15,7.62) 40.79,6.98 40.79,4.92 ; v1(45.72,30.25) 47.23,30.25
  Bottom Layer w0.254: v1(40.15,7.62) 40.15,26.01 44.39,30.25 v1(45.72,30.25)
IO11: length 31.3
  Top Layer w0.254: v1(45.07,30.75) FPC1.22 ; 39.52,4.92 39.52,7.42 v1(39.31,7.62)
  Bottom Layer w0.254: v1(39.31,7.62) 39.31,26.36 43.71,30.75 v1(45.07,30.75)
IR: length 4.8
  Top Layer w0.127: 28.05,36.09 28.05,37.22 28.56,37.73 28.93,37.73 30.49,39.29 30.49,39.72
LX_1.1: length 8.1
  Top Layer w0.381: U16.2 6.78,30.14 5.23,28.59 2.29,28.59 C77.2
  Top Layer w0.635: U16.2 8.55,30.14 L7.1
LX_3.3: length 6.4
  Top Layer w0.381: U15.2 6.8,22.9 5.24,21.34 2.58,21.34 C71.2
MIPI0_CN: length 17
  Top Layer w0.102: 32.32,38.8 32.32,38.34 34.02,36.64 37.98,36.64 40.22,38.87 46.26,38.87 46.38,38.75 FPC1.38
MIPI0_CP: length 17
  Top Layer w0.102: FPC1.39 46.38,39.25 46.26,39.13 43.84,39.13 arc(43.75,39.17) 43.71,39.25 43.71,39.27 arc(43.58,39.39) 43.46,39.27 43.46,39.25 arc(43.33,39.13) 43.2,39.25 43.2,39.27 arc(43.07,39.39) 42.95,39.27 42.95,39.25 arc(42.82,39.13) 42.69,39.25 42.69,39.27 arc(42.57,39.39) 42.44,39.27 42.44,39.25 arc(42.4,39.17) 42.31,39.13 40.11,39.13 37.88,36.9 34.12,36.9 32.78,38.24 U1.F10
MIPI0_D0N: length 18.1
  Top Layer w0.102: U1.H9 31.41,37.42 34.28,34.55 39.1,34.55 40.43,35.87 46.26,35.87 46.38,35.75 FPC1.32
MIPI0_D0P: length 18.1
  Top Layer w0.102: FPC1.33 46.38,36.25 46.26,36.13 43.86,36.13 arc(43.77,36.17) 43.73,36.26 43.73,36.35 arc(43.6,36.48) 43.48,36.35 43.48,36.26 arc(43.35,36.13) 43.22,36.26 43.22,36.35 arc(43.1,36.48) 42.97,36.35 42.97,36.26 arc(42.93,36.17) 42.84,36.13 40.33,36.13 39,34.8 34.38,34.8 31.86,37.32 U1.H10
MIPI0_D1N: length 17.5
  Top Layer w0.102: U1.G9 31.86,37.88 34.13,35.61 38.59,35.61 40.36,37.37 46.26,37.37 46.38,37.25 FPC1.35
MIPI0_D1P: length 17.5
  Top Layer w0.102: 32.32,37.88 32.32,37.78 34.24,35.86 38.49,35.86 40.25,37.63 44.1,37.63 arc(44.19,37.67) 44.23,37.75 44.23,37.85 arc(44.35,37.98) 44.48,37.85 44.48,37.75 arc(44.61,37.63) 44.73,37.75 44.73,37.85 arc(44.86,37.98) 44.99,37.85 44.99,37.75 arc(45.03,37.67) 45.12,37.63 46.26,37.63 46.38,37.75 FPC1.36
MIPI0_D2N: length 16.5
  Top Layer w0.102: 47.23,40.25 46.38,40.25 46.26,40.37 40.16,40.37 37.51,37.72 33.86,37.72 32.78,38.8 U1.E9
MIPI0_D2P: length 16.5
  Top Layer w0.102: U1.E10 33.24,38.7 33.96,37.98 37.4,37.98 40.05,40.63 43.83,40.63 arc(43.92,40.67) 43.96,40.75 43.96,40.77 arc(44.09,40.89) 44.22,40.77 44.22,40.75 arc(44.34,40.63) 44.47,40.75 44.47,40.77 arc(44.6,40.89) 44.72,40.77 44.72,40.75 arc(44.85,40.63) 44.98,40.75 44.98,40.77 arc(45.1,40.89) 45.23,40.77 45.23,40.75 arc(45.27,40.67) 45.36,40.63 46.26,40.63 46.38,40.75 FPC1.42
MIPI0_D3N: length 16.1
  Top Layer w0.102: FPC1.44 46.38,41.75 46.26,41.87 39.7,41.87 36.5,38.67 33.83,38.67 33.24,39.26 33.24,39.72
MIPI0_D3P: length 16.1
  Top Layer w0.102: FPC1.45 46.38,42.25 46.26,42.13 43.59,42.13 arc(43.5,42.17) 43.46,42.25 43.46,42.35 arc(43.34,42.48) 43.21,42.35 43.21,42.25 arc(43.08,42.13) 42.96,42.25 42.96,42.35 arc(42.83,42.48) 42.7,42.35 42.7,42.25 arc(42.66,42.17) 42.57,42.13 39.59,42.13 36.39,38.92 33.93,38.92 33.7,39.16 U1.D10
MIPI1_CN: length 16
  Top Layer w0.102: U1.B7 33.7,41.55 38.52,46.37 46.26,46.37 46.38,46.25 FPC1.53
MIPI1_CP: length 16.1
  Top Layer w0.102: 47.23,46.75 46.38,46.75 46.26,46.63 44.79,46.63 arc(44.7,46.67) 44.66,46.76 arc(44.54,46.88) 44.41,46.76 arc(44.28,46.63) 44.16,46.76 arc(44.03,46.88) 43.9,46.76 arc(43.87,46.67) 43.78,46.63 38.42,46.63 33.81,42.01 U1.A7
MIPI1_D0N: length 14.3
  Top Layer w0.102: U1.B9 34.62,40.64 37.36,43.37 46.26,43.37 46.38,43.25 47.23,43.25
MIPI1_D0P: length 14.3
  Top Layer w0.102: U1.A9 34.72,41.09 37.26,43.63 44.03,43.63 arc(44.12,43.67) 44.15,43.76 arc(44.28,43.88) 44.41,43.76 arc(44.54,43.63) 44.66,43.76 arc(44.79,43.88) 44.92,43.76 arc(44.95,43.67) 45.04,43.63 46.26,43.63 46.38,43.75 FPC1.48
MIPI1_D1N: length 15.1
  Top Layer w0.102: FPC1.50 46.38,44.75 46.26,44.87 37.94,44.87 34.16,41.09 U1.B8
MIPI1_D1P: length 15.2
  Top Layer w0.102: U1.A8 34.26,41.55 37.84,45.13 42,45.13 arc(42.09,45.16) 42.12,45.25 arc(42.25,45.38) 42.38,45.25 arc(42.5,45.13) 42.63,45.25 arc(42.76,45.38) 42.88,45.25 arc(42.92,45.16) 43.01,45.13 46.26,45.13 46.38,45.25 FPC1.51
MIPI1_D2N: length 17.4
  Top Layer w0.102: FPC1.56 46.38,47.75 46.26,47.87 38.37,47.87 35.95,45.46 35.95,44.72 33.25,42.01 U1.B6
MIPI1_D2P: length 17.4
  Top Layer w0.102: FPC1.57 46.38,48.25 46.26,48.13 43.27,48.13 arc(43.18,48.16) 43.15,48.25 arc(43.02,48.38) 42.89,48.25 arc(42.77,48.13) 42.64,48.25 arc(42.51,48.38) 42.38,48.25 arc(42.35,48.16) 42.26,48.13 38.26,48.13 35.69,45.56 35.69,44.82 33.35,42.47 33.24,42.47
MIPI1_D3N: length 18.5
  Top Layer w0.102: FPC1.59 46.38,49.25 46.26,49.37 38.44,49.37 34.58,45.51 34.58,44.26 32.79,42.47 32.32,42.47
MIPI1_D3P: length 18.6
  Top Layer w0.102: U1.A5 32.89,42.93 34.32,44.37 34.32,45.61 38.34,49.63 43.36,49.63 arc(43.45,49.67) 43.49,49.76 arc(43.62,49.88) 43.74,49.76 arc(43.87,49.63) 44,49.76 arc(44.12,49.88) 44.25,49.76 arc(44.29,49.67) 44.38,49.63 46.26,49.63 46.38,49.75 47.23,49.75
PCKIN: length 12.7
  Top Layer w0.127: v1(20.6,32.01) 20.85,31.76 21.58,31.76
  Top Layer w0.254: v2(25.56,40.13) 26.07,40.64 U1.K1
  Bottom Layer w0.254: v2(25.56,40.13) 21.81,36.38 21.81,33.22 v1(20.6,32.01)
PFIL: length 17.1
  Top Layer w0.254: v1(18.12,34.2) 19.43,32.9 C8.2 18.39,30.91 R18.2 ; v2(26.7,40.17) 26.71,40.18 U1.K2
  Bottom Layer w0.254: v2(26.7,40.17) 26.26,40.62 24.97,40.62 20.9,36.54 20.9,35.23 19.86,34.2 v1(18.12,34.2)
RESET_STM: length 36.8
  Top Layer w0.254: v1(28.09,3.28) 28.09,4.92 ; SW4.1 44.97,1.21 44.02,2.17 41.83,2.17 C87.1 41.01,2.99 39.57,2.99 v1(39.02,2.43) ; R24.1 19.11,3.85 18.7,4.26 v1(17.48,4.26) 16.77,4.97 Q3.3
  Bottom Layer w0.254: v1(39.02,2.43) 28.94,2.43 v1(28.09,3.28) 26.81,4.56 23.69,4.56 23.56,4.42 17.65,4.42 v1(17.48,4.26)
RESET_TC: length 38.8
  Top Layer w0.127: R9.1 28.94,35.23 v2(30.02,36.32) 30.02,37.41 U1.K8
  Top Layer w0.254: v1(34.45,6.56) 34.44,6.55 34.44,4.92
  Bottom Layer w0.254: v2(30.02,36.32) 36.96,29.38 36.96,7.71 35.81,6.56 v1(34.45,6.56)
REXT: length 5.2
  Top Layer w0.254: v1(31.79,48.11) R10.1 ; v1(30.3,46.03) 30.95,45.38 30.95,44.77
  Bottom Layer w0.254: v1(30.3,46.03) 31.79,47.53 v1(31.79,48.11)
RTS: length 8.5
  Top Layer w0.254: Q3.2 13.37,4.38 13.37,3.93 12.71,3.27 R76.1 9.12,3.27 7.98,2.13 U19.14
RXD: length 33
  Top Layer w0.254: 29.36,22.92 29.36,21.66 28.47,20.78 17.73,20.78 16.82,19.87 16.82,12.99 13.72,9.89 9.99,9.89 7.98,7.88 U19.3
TEST: length 4.7
  Top Layer w0.127: R13.1 27.16,37.79 29.55,40.18 U1.G5
TXD: length 33
  Top Layer w0.254: 30.63,22.92 30.63,21.4 29.11,19.89 18.24,19.89 17.61,19.26 17.61,12.59 14.04,9.02 10.4,9.02 9.25,7.88 U19.2
USB_N: length 18.3
  Top Layer w0.122: v1(5.8,14.2) 6.12,14.2 6.25,14.07 7.04,14.07 7.17,14.2 USB1.7 ; USB1.5 7.17,15.2 7.04,15.07 4.13,15.07 3.5,14.44 3.5,13.13 3.38,13.01 v1(3.38,12.68) 3.38,12.35 3.5,12.23 3.5,11.68 4.68,10.49 4.68,8.79 4.17,8.28 U19.6
  Bottom Layer w0.122: v1(3.38,12.68) 3.38,13.01 3.5,13.13 3.5,13.64 3.93,14.07 5.35,14.07 5.47,14.2 v1(5.8,14.2)
USB_P: length 18.3
  Top Layer w0.122: v1(5.8,13.69) 6.12,13.69 6.25,13.82 7.04,13.82 7.17,13.7 USB1.8 ; USB1.6 7.17,14.7 7.04,14.82 4.24,14.82 3.75,14.34 3.75,13.13 3.88,13.01 v1(3.88,12.68) 3.88,12.35 3.75,12.23 3.75,11.78 4.94,10.6 4.94,10.13 arc(4.97,10.04) 5.06,10.01 5.12,10.01 arc(5.25,9.88) 5.12,9.75 5.06,9.75 arc(4.94,9.62) 5.06,9.5 5.12,9.5 arc(5.25,9.37) 5.12,9.24 5.06,9.24 arc(4.97,9.21) 4.94,9.12 4.94,8.79 5.44,8.28 U19.5
  Bottom Layer w0.122: v1(5.8,13.69) 5.47,13.69 5.35,13.82 4.04,13.82 3.75,13.53 3.75,13.13 3.88,13.01 v1(3.88,12.68)
USR_LED: length 30.1
  Top Layer w0.254: 36.98,22.92 36.98,21.98 37.78,21.18 v1(38.79,21.18) ; FPC2.3 45.73,10.72 v1(45.1,11.34)
  Bottom Layer w0.254: v1(38.79,21.18) 38.79,7.18 39.82,6.15 42.95,6.15 45.1,8.31 v1(45.1,11.34)
$1N1752: length 14.8
  Top Layer w0.127: U1.A3 32.3,44.29 32.3,45.28 29.85,47.73 23.43,47.73 22.63,48.54 22.63,49.33 21.67,50.28 R7.2
$1N1792: length 17.3
  Top Layer w0.127: U1.B3 31.9,43.39 32.57,44.07 32.57,45.39 29.96,48 23.52,48 22.87,48.65 22.87,50.42 21.67,51.62 R8.2
$1N2020: length 3.3
  Top Layer w0.127: 24.49,39.64 25.21,39.64 25.28,39.72 27.73,39.72
$1N2024: length 2.5
  Top Layer w0.127: U1.K4 26.8,37.87 26.8,37.87 R15.1
$1N3665: length 5.3
  Top Layer w0.381: R17.2 22.32,33.21 Q1.1 24.47,33.21 25.87,31.81
$1N3878: length 5.6
  Top Layer w0.381: Q1.2 22.87,30.77 22.57,30.77 22.57,31.93 21.46,33.03 R19.2
$1N4917: length 1.4
  Top Layer w0.254: C11.2 19.38,29.8 R18.1
$1N5220: length 3.2
  Top Layer w0.305: X1.3 28.46,30.33 28.46,31.51 28.76,31.81 R14.2
$1N115816: length 4.1
  Top Layer w0.254: USB1.4 10.23,15.69 10.94,16.41 R75.2
$1N115820: length 4
  Top Layer w0.254: USB1.10 10.71,12.69 10.97,12.44 R74.2
$2N42080: length 2.5
  Top Layer w0.254: R76.2 12.68,2.11 14.06,3.49 Q2.1
$2N42119: length 1.7
  Top Layer w0.254: R77.2 12.88,7.21 Q3.1
$3N55984: length 1.3
  Top Layer w0.254: R34.2 14.34,18.42 LED2.1

## Copper pours and planes (outline as drawn; the poured copper is in the pictures)
GND on Top Layer: 27.25,40.71 31.03,44.49 34.82,40.7 31.04,36.91
GND on Top Layer: -0.04,43.7 53.79,43.7 53.79,0 -0.04,0
GND on Bottom Layer: 27.25,40.71 31.03,44.49 34.82,40.7 31.04,36.91
GND on Bottom Layer: -0.04,43.7 53.79,43.7 53.79,0 -0.04,0
GND on Inner1: -0.04,43.7 53.79,43.7 53.79,0 -0.04,0
GND_P on Top Layer: 43.05,31.66 38.38,31.66 38.38,33.28 43.05,33.28
GND_P on Top Layer: 30.98,33.1 46.2,33.1 46.16,35.52 53.79,35.52 53.79,54.16 30.98,54.16
GND_P on Top Layer: 35.12,33.95 35.12,29.17 44.67,29.17 44.67,33.95
GND_P on Top Layer: 37.35,31.67 36.44,31.67 36.44,33.28 37.35,33.28
GND_P on Bottom Layer: 30.98,33.59 46.19,33.59 46.16,35.52 53.79,35.52 53.79,54.16 30.98,54.16
GND_P on Bottom Layer: 36.32,31.52 43.23,31.52 43.23,33.95 36.32,33.95
GND_P on Inner1: 30.98,33.59 46.19,33.59 46.16,35.52 53.79,35.52 53.79,54.16 30.98,54.16
GND_P on Inner1: 35.24,29.17 37.19,29.17 37.19,28.02 38.18,28.02 38.18,29.18 44.67,29.17 44.67,33.95 35.24,33.95
GND_TMDS on Top Layer: -0.04,54.14 30.97,54.14 30.97,47.58 33.08,45.62 28.46,40.65 22.33,40.65 16.85,35.3 -0.04,35.3
GND_TMDS on Bottom Layer: -0.04,54.14 30.97,54.14 30.97,47.58 33.08,45.62 28.46,40.65 22.33,40.65 16.85,35.3 -0.04,35.3
GND_TMDS on Inner1: -0.04,54.14 30.97,54.14 30.97,47.58 33.08,45.62 28.46,40.65 22.33,40.65 16.85,35.3 -0.04,35.3
V1.1 on Top Layer: 9.39,31.17 11.34,31.17 11.34,28.91 9.39,28.91
V1.1 on Top Layer: 44.93,22.44 48.03,22.44 48.03,21.06 44.93,21.06
V1.8_P on Top Layer: 44.94,23.95 48.04,23.95 48.04,22.57 44.94,22.57
V3.3 on Top Layer: 45.32,7.46 47.96,7.46 47.96,6.97 45.32,6.97
V3.3 on Top Layer: 46.44,25.48 49.4,25.48 49.4,24.07 46.44,24.07
V3.3 on Top Layer: 14.58,22.85 14.58,24.79 10.07,24.79 10.07,21.77 11.56,21.77 11.56,22.85
V5 on Top Layer: 7.28,12.34 10.51,12.34 10.51,11.74 7.28,11.74
V5 on Top Layer: 7.28,17.15 10.51,17.15 10.51,16.54 7.28,16.54
V5 on Top Layer: 4.07,30.13 10.77,30.13 10.77,33.53 5.87,33.52 5.87,34.86 4.07,34.86
V5 on Top Layer: 46.44,32.95 49.63,32.95 49.63,31.05 46.44,31.05
V5 on Top Layer: 3.87,24.22 7.86,24.22 7.86,22.37 3.87,22.37
V5 on Top Layer: 3.9,24.89 10.67,24.89 10.67,26.48 5.91,26.48 5.9,27.75 3.9,27.75
V5 on Bottom Layer: 5.23,34.8 6.34,34.8 6.34,29.51 5.23,29.51
V5 on Inner2: 8.85,17.14 10.53,17.14 10.53,11.74 8.85,11.74
LX_3.3 on Top Layer: 6.54,23.36 8.97,23.36 8.97,22.44 6.54,22.44

Small or netless copper shapes (teardrops, artwork), in the pictures only: 434 on Top Layer, 67 on Bottom Layer, 25 on Inner2

## Text on the board
Top Silkscreen Layer: JLCJLCJLCJLC | RST
